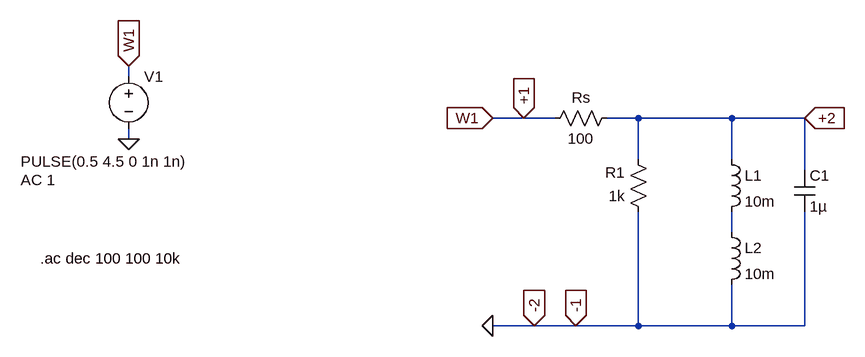
[diagram p0: schematic paralel_RLC_circuit.asc]
paralel_RLC_circuit.asc, the LTspice schematic file:
Version 4
SHEET 1 880 680
WIRE -512 32 -512 16
WIRE 96 96 48 96
WIRE 144 96 96 96
WIRE 272 96 224 96
WIRE 416 96 272 96
WIRE 528 96 416 96
WIRE -512 128 -512 112
WIRE 272 160 272 96
WIRE 416 160 416 96
WIRE 528 176 528 96
WIRE 416 272 416 240
WIRE 112 416 48 416
WIRE 176 416 112 416
WIRE 272 416 272 240
WIRE 272 416 176 416
WIRE 416 416 416 352
WIRE 416 416 272 416
WIRE 528 416 528 240
WIRE 528 416 416 416
FLAG 48 96 W1
IOPIN 48 96 In
FLAG -512 16 W1
IOPIN -512 16 In
FLAG -512 128 0
FLAG 528 96 +2
IOPIN 528 96 In
FLAG 96 96 +1
IOPIN 96 96 In
FLAG 112 416 -2
IOPIN 112 416 In
FLAG 176 416 -1
IOPIN 176 416 In
FLAG 48 416 0
SYMBOL res 240 80 R90
WINDOW 0 0 56 VBottom 2
WINDOW 3 32 56 VTop 2
SYMATTR InstName Rs
SYMATTR Value 100
SYMBOL res 288 256 R180
WINDOW 0 36 76 Left 2
WINDOW 3 36 40 Left 2
SYMATTR InstName R1
SYMATTR Value 1k
SYMBOL ind 400 144 R0
SYMATTR InstName L1
SYMATTR Value 10m
SYMBOL cap 512 176 R0
SYMATTR InstName C1
SYMATTR Value 1µ
SYMBOL voltage -512 16 R0
WINDOW 3 -166 147 Left 2
WINDOW 123 -166 175 Left 2
WINDOW 39 0 0 Left 0
SYMATTR Value PULSE(0.5 4.5 0 1n 1n)
SYMATTR Value2 AC 1
SYMATTR InstName V1
SYMBOL ind 400 256 R0
SYMATTR InstName L2
SYMATTR Value 10m
TEXT -648 312 Left 2 !.ac dec 100 100 10k

The netlist it stands for:
* paralel_RLC_circuit.asc
Rs +2 +1 100
R1 0 +2 1k
L1 +2 N001 10m
C1 +2 0 1µ
V1 +1 0 PULSE(0.5 4.5 0 1n 1n) AC 1
L2 N001 0 10m
.ac dec 100 100 10k
.backanno
.end